# Altium project Hvamp_32.PrjPCB (part 2 of 2)

## Sheet Hvamp32_Supply.SchDoc: HVAMP_32
size 420 x 297 mm; EDA_Number: ARTIQ; Projet: Zotino; Author: G.Kasprowicz; CompanyName: WUT ISE; DrawnBy: G.Kasprowicz; Organization: WUT ISE; Address1: PW ISE; Address2: Nowowiejska 15/19 00-665 Warsaw; Address3: gkasprow@gmail.com; DocumentNumber: 3; Revision: 2; SheetNumber: 3; SheetTotal: 3; ModifiedBy: -; CheckedDate: -; Title2: Power Supply; DivGrp: WUT ISE; Designer: G.Kasprowicz; ModifiedDate: -; ProjectName: Sensor Box
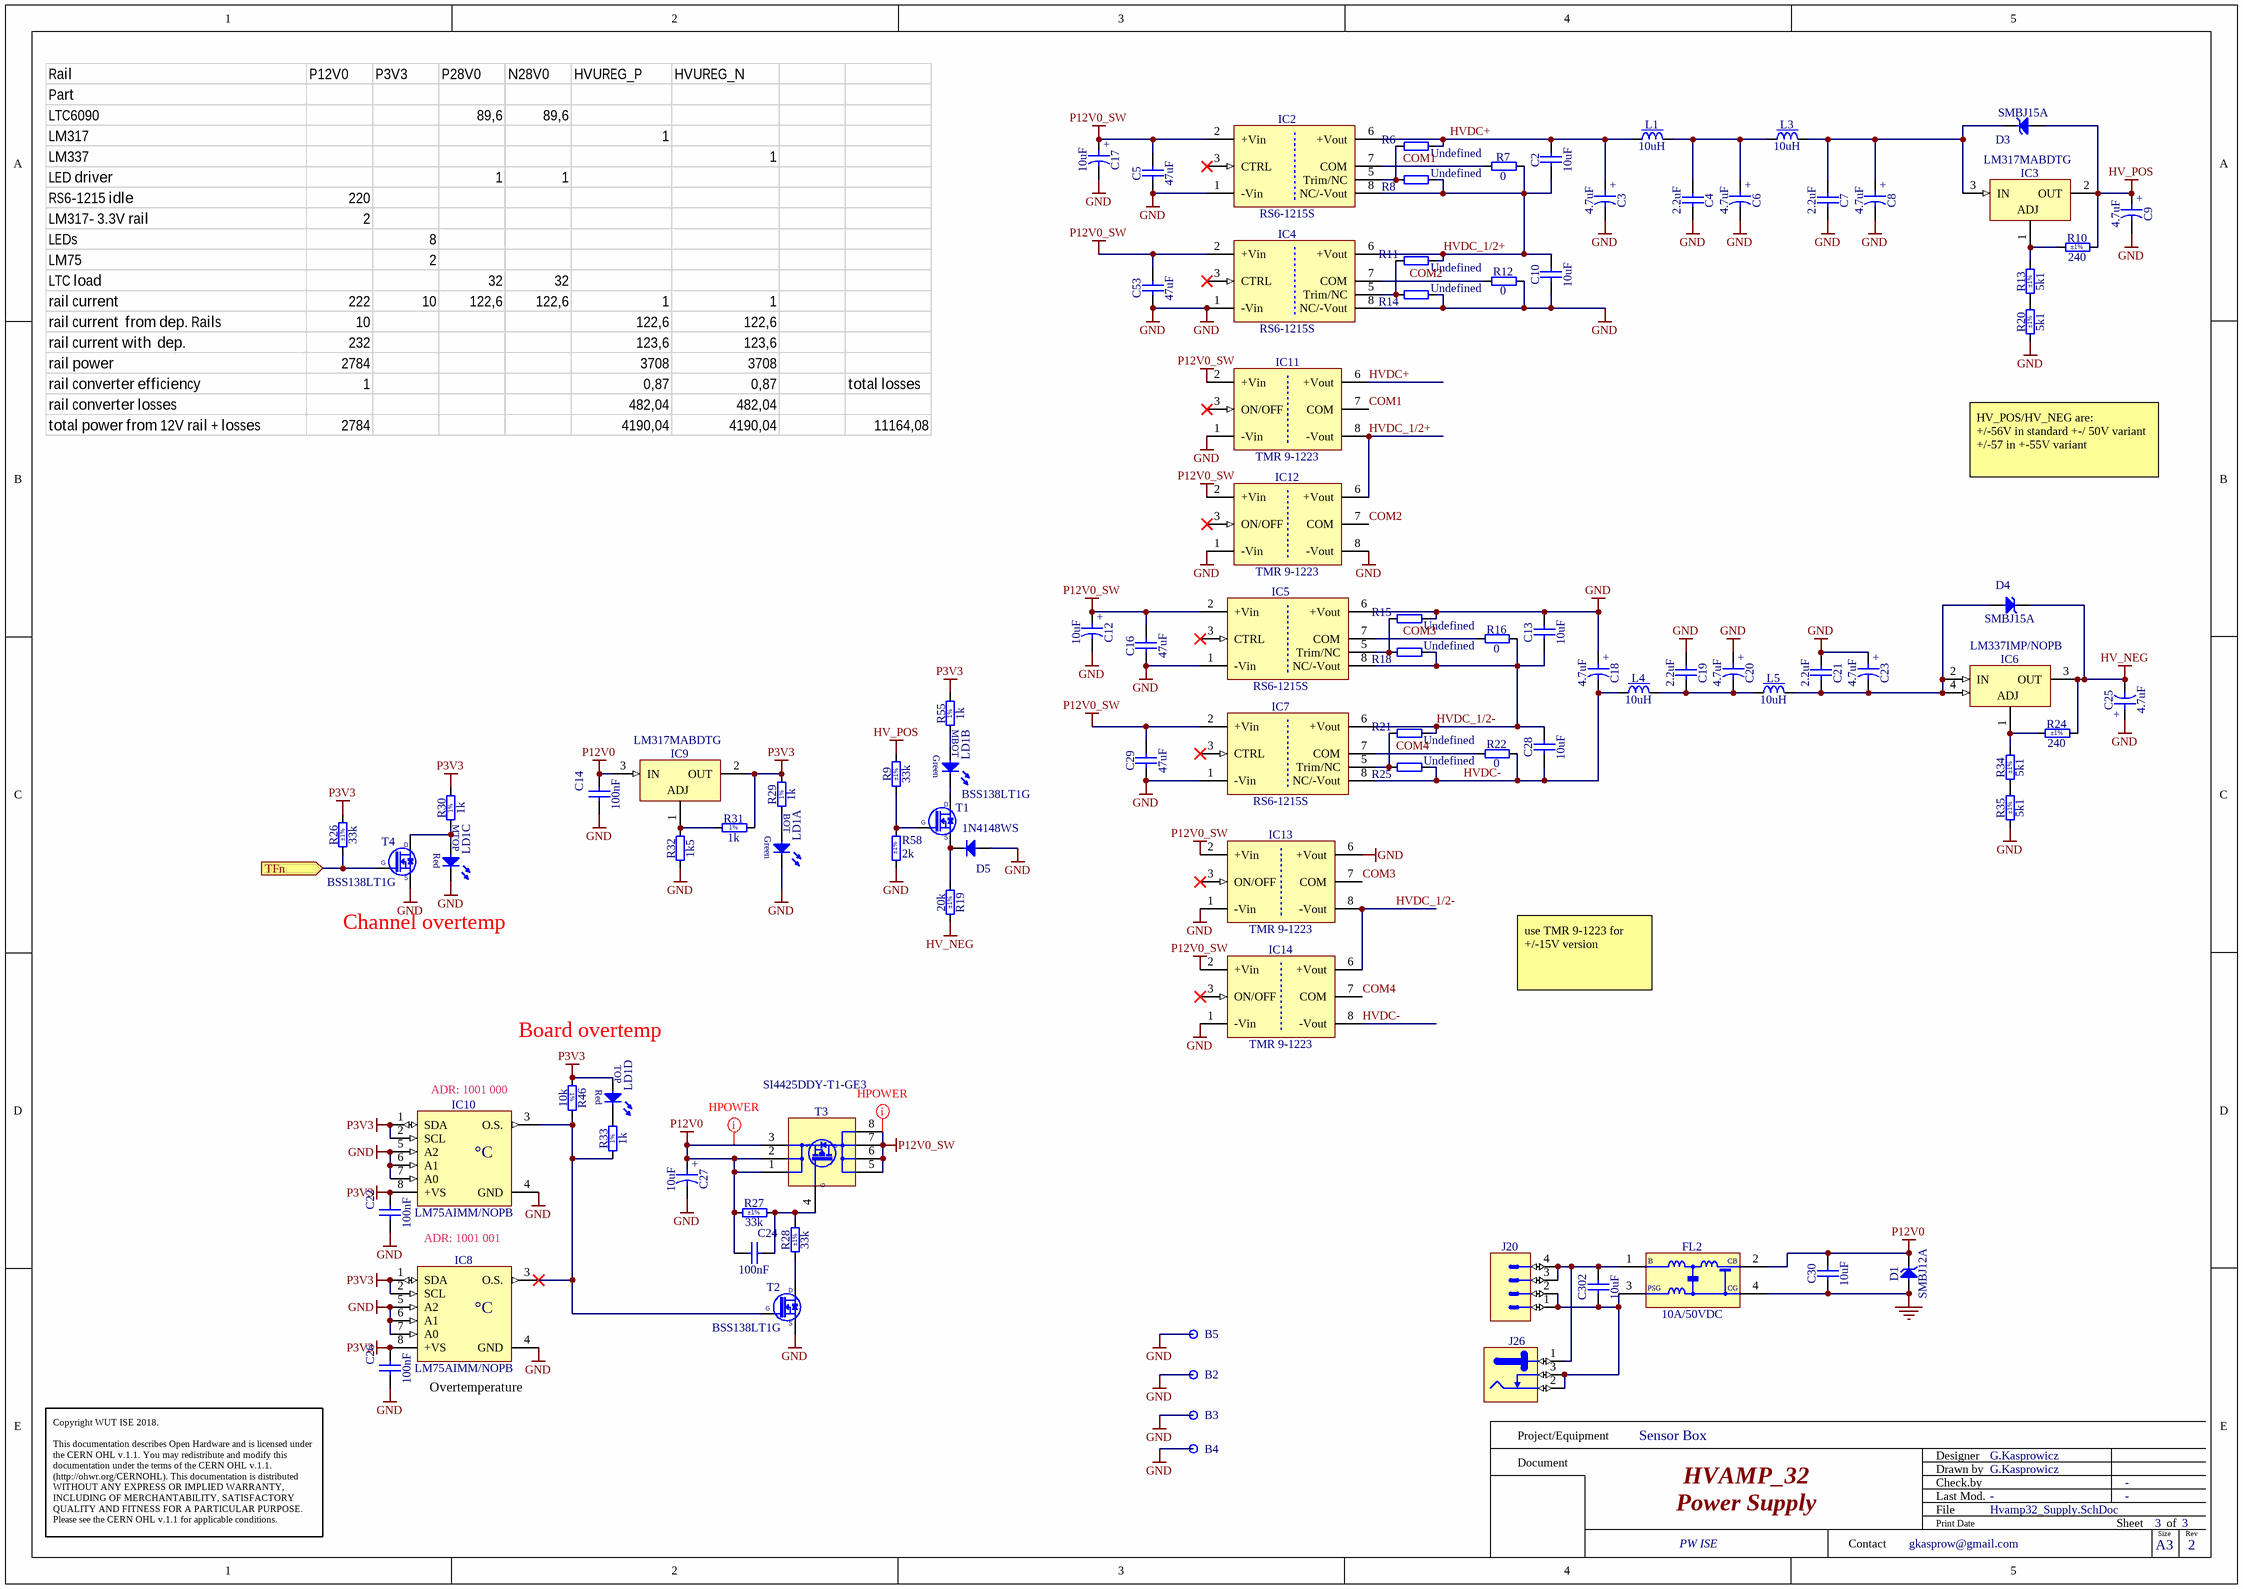
[diagram p2: Hvamp32_Supply.SchDoc]

### Parts
B2  Plated Hole  [MTG320_700]  (value not drawn)  (no BOM)
B3  Plated Hole  [MTG320_700]  (value not drawn)  (no BOM)
B4  Plated Hole  [MTG320_700]  (value not drawn)  (no BOM)
B5  Plated Hole  [MTG320_700]  (value not drawn)  (no BOM)
C2  10uF  [CAPC2012X145N]
C3  4.7uF  [CAPAE9383X100M]
C4  2.2uF  [CAPC3225X230N]
C5  47uF  [CAPC3225X270N]
C6  4.7uF  [CAPAE9383X100M]
C7  2.2uF  [CAPC3225X230N]
C8  4.7uF  [CAPAE9383X100M]
C9  4.7uF  [CAPAE9383X100M]
C10  10uF  [CAPC2012X145N]
C12  10uF  [CAPMP6032X280N]
C13  10uF  [CAPC2012X145N]
C14  100nF  [CAPC1608X90N]
C16  47uF  [CAPC3225X270N]
C17  10uF  [CAPMP6032X280N]
C18  4.7uF  [CAPAE9383X100M]
C19  2.2uF  [CAPC3225X230N]
C20  4.7uF  [CAPAE9383X100M]
C21  2.2uF  [CAPC3225X230N]
C22  100nF  [CAPC1608X90N]
C23  4.7uF  [CAPAE9383X100M]
C24  100nF  [CAPC1608X90N]
C25  4.7uF  [CAPAE9383X100M]
C26  100nF  [CAPC1608X90N]
C27  10uF  [CAPMP6032X280N]
C28  10uF  [CAPC2012X145N]
C29  47uF  [CAPC3225X270N]
C30  10uF  [CAPC2012X95N]
C53  47uF  [CAPC3225X270N]
C302  10uF  [CAPC2012X95N]
D1  SMBJ12A  [DIOM5336X265N]
D3  SMBJ15A  [DIOM5336X265N]
D4  SMBJ15A  [DIOM5336X265N]
D5  1N4148WS  [SODFL2512X100N]
FL2  10A/50VDC  [FIL_MURATA_BNX02]
IC2  RS6-1215S  [DCDC_RECOM_RS6]
IC3  LM317MABDTG  [DIODES-INC_TO-252-3L]
IC4  RS6-1215S  [DCDC_RECOM_RS6]
IC5  RS6-1215S  [DCDC_RECOM_RS6]
IC6  LM337IMP/NOPB  [SOT230P700X180-4N]
IC7  RS6-1215S  [DCDC_RECOM_RS6]
IC8  LM75AIMM/NOPB  [SOP65P490X109-8N]
IC9  LM317MABDTG  [DIODES-INC_TO-252-3L]
IC10  LM75AIMM/NOPB  [SOP65P490X109-8N]
IC11  TMR 9-1223  [DCDC_TRACO_TMR9WI]
IC12  TMR 9-1223  [DCDC_TRACO_TMR9WI]
IC13  TMR 9-1223  [DCDC_TRACO_TMR9WI]
IC14  TMR 9-1223  [DCDC_TRACO_TMR9WI]
J20  Mini-Fit Jr.™  [MOLEX_39-30-0040]  (value not drawn)
J26  Jack  [SWITCHCRAFT_712RA]  (value not drawn)
L1  10uH  [IND_MURATA-PS_8400]
L3  10uH  [IND_MURATA-PS_8400]
L4  10uH  [IND_MURATA-PS_8400]
L5  10uH  [IND_MURATA-PS_8400]
LD1  Green/Green/HeRed/HeRed  [LED_BIVAR_H485CHHGGDL]  (value not drawn)  (parts A,B,C,D of 4)
R6  Undefined  [RESC1608X55N]
R7  0  [RESC1608X55N]
R8  Undefined  [RESC1608X55N]
R9  33k  Tolerance: ±1%  [RESC1608X55N]
R10  240  Tolerance: ±1%  [RESC1608X55N]
R11  Undefined  [RESC1608X55N]
R12  0  [RESC1608X55N]
R13  5k1  Tolerance: ±1%  [RESC3216X65N]
R14  Undefined  [RESC1608X55N]
R15  Undefined  [RESC1608X55N]
R16  0  [RESC1608X55N]
R18  Undefined  [RESC1608X55N]
R19  20k  Tolerance: ±1%  [RESC1608X55N]
R20  5k1  Tolerance: ±1%  [RESC3216X65N]
R21  Undefined  [RESC1608X55N]
R22  0  [RESC1608X55N]
R24  240  Tolerance: ±1%  [RESC1608X55N]
R25  Undefined  [RESC1608X55N]
R26  33k  Tolerance: ±1%  [RESC1608X55N]
R27  33k  Tolerance: ±1%  [RESC1608X55N]
R28  33k  Tolerance: ±1%  [RESC1608X55N]
R29  1k  [RESC1005X40N]
R30  1k  [RESC1005X40N]
R31  1k  [RESC1005X40N]
R32  1k5  [RESC1005X40N]
R33  1k  [RESC1005X40N]
R34  5k1  Tolerance: ±1%  [RESC3216X65N]
R35  5k1  Tolerance: ±1%  [RESC3216X65N]
R46  10k  [RESC1005X40N]
R55  1k  [RESC1005X40N]
R58  2k  Tolerance: ±1%  [RESC1005X40N]
T1  BSS138LT1G  [SOT95P240X110-3N]
T2  BSS138LT1G  [SOT95P240X110-3N]
T3  SI4425DDY-T1-GE3  [SOIC127P600X175-8N]
T4  BSS138LT1G  [SOT95P240X110-3N]

### Ports
TFn (in)

### Nets
GND: B2.1 B3.1 B4.1 B5.1 C3.2 C4.2 C5.1 C6.2 C7.2 C8.2 C9.2 C10.1 C12.2 C13.2 C14.1 C16.1 C17.2 C18.1 C19.1 C20.1 C21.1 C22.1 C23.1 C25.1 C26.1 C27.2 C29.1 C30.1 C53.1 D1.2(A) D5.2(A) FL2.4(CG) IC2.1(-Vin) IC4.1(-Vin) IC4.8(NC/-Vout) IC5.1(-Vin) IC5.6(+Vout) IC7.1(-Vin) IC8.4(GND) IC8.5(A2) IC8.6(A1) IC8.7(A0) IC10.4(GND) IC10.5(A2) IC10.6(A1) IC10.7(A0) IC11.1(-Vin) IC12.1(-Vin) IC12.8(-Vout) IC13.1(-Vin) IC13.6(+Vout) IC14.1(-Vin) LD1.1(C) LD1.5(C) R12.2 R14.2 R15.2 R20.1 R32.1 R35.1 R58.1 T2.2(S) T4.2(S)
HV_NEG: C25.2 D4.1(C) IC6.3(OUT) R19.2 R24.2
HV_POS: C9.1 D3.2(A) IC3.2(OUT) R9.2 R10.2
P3V3: C22.2 C26.2 IC8.1(SDA) IC8.2(SCL) IC8.8(+VS) IC9.2(OUT) IC10.1(SDA) IC10.2(SCL) IC10.8(+VS) LD1.8(A) R26.2 R29.2 R30.2 R31.2 R46.1 R55.2
P12V0: C14.2 C24.1 C27.1 C30.2 D1.1(C) FL2.2(CB) IC9.3(IN) R27.1 T3.1(S) T3.2(S) T3.3(S)
P12V0_SW: C5.2 C12.1 C16.2 C17.1 C29.2 C53.2 IC2.2(+Vin) IC4.2(+Vin) IC5.2(+Vin) IC7.2(+Vin) IC11.2(+Vin) IC12.2(+Vin) IC13.2(+Vin) IC14.2(+Vin) T3.5(D) T3.6(D) T3.7(D) T3.8(D)
COM1: IC2.7(COM) IC11.7(COM) R7.1
COM2: IC4.7(COM) IC12.7(COM) R12.1
COM3: IC5.7(COM) IC13.7(COM) R16.1
COM4: IC7.7(COM) IC14.7(COM) R22.1
HVDC+: C2.2 C3.1 IC2.6(+Vout) IC11.6(+Vout) L1.1 R6.2
HVDC-: C18.2 C28.1 IC7.8(NC/-Vout) IC14.8(-Vout) L4.1 R22.2 R25.2
HVDC_1/2+: C2.1 C10.2 IC2.8(NC/-Vout) IC4.6(+Vout) IC11.8(-Vout) IC12.6(+Vout) R7.2 R8.2 R11.2
HVDC_1/2-: C13.1 C28.2 IC5.8(NC/-Vout) IC7.6(+Vout) IC13.8(-Vout) IC14.6(+Vout) R16.2 R18.2 R21.2
NetC4_1: C4.1 C6.1 L1.2 L3.1
NetC7_1: C7.1 C8.1 D3.1(C) IC3.3(IN) L3.2
NetC19_2: C19.2 C20.2 L4.2 L5.1
NetC21_2: C21.2 C23.2 D4.2(A) IC6.2(IN) IC6.4(IN) L5.2
NetC24_2: C24.2 R27.2 R28.2 T3.4(S)
NetC302_1: C302.1 FL2.3(PSG) J20.1 J20.2 J26.2 J26.3
NetC302_2: C302.2 FL2.1(B) J20.3 J20.4 J26.1
NetD2_1_2: R26.1 T4.1(G) ; port TFn
NetD5_1: D5.1(C) R19.1 T1.2(S)
NetIC2_5: IC2.5(Trim/NC) R6.1 R8.1
NetIC3_1: IC3.1(ADJ) R10.1 R13.2
NetIC4_5: IC4.5(Trim/NC) R11.1 R14.1
NetIC5_5: IC5.5(Trim/NC) R15.1 R18.1
NetIC6_1: IC6.1(ADJ) R24.1 R34.2
NetIC7_5: IC7.5(Trim/NC) R21.1 R25.1
NetIC8_3: IC8.3(O.S.) IC10.3(O.S.) R33.1 R46.2 T2.1(G)
NetIC9_1: IC9.1(ADJ) R31.1 R32.2
NetLD1_2: LD1.2(A) R29.1
NetLD1_3: LD1.3(C) T1.3(D)
NetLD1_4: LD1.4(A) R55.1
NetLD1_6: LD1.6(A) R30.1 T4.3(D)
NetLD1_7: LD1.7(C) R33.2
NetR9_1: R9.1 R58.2 T1.1(G)
NetR13_1: R13.1 R20.2
NetR28_1: R28.1 T2.3(D)
NetR34_1: R34.1 R35.2

Not connected (* = marked no-connect by the designer): IC2 3(CTRL)*; IC4 3(CTRL)*; IC5 3(CTRL)*; IC7 3(CTRL)*; IC11 3(ON/OFF)*; IC12 3(ON/OFF)*; IC13 3(ON/OFF)*; IC14 3(ON/OFF)*

### Layout directives
net class Hpower: P12V0, P12V0_SW

### Notes on the sheet
- HV_POS/HV_NEG are:
  +/-56V in standard +-/ 50V variant
  +/-57 in +-55V variant
- Channel overtemp
- use TMR 9-1223 for +/-15V version
- Board overtemp
- (near IC10) ADR: 1001 000
- ADR: 1001 001
- Overtemperature
- Project/Equipment
- Document
- Designer
- Drawn by
- Check.by
- Copyright WUT ISE 2018.
  This documentation describes Open Hardware and is licensed under the CERN OHL v.1.1. You may redistribute and modify this documentation under the terms of the CERN OHL v.1.1. (http://ohwr.org/CERNOHL). This documentation is distributed WITHOUT ANY EXPRESS OR IMPLIED WARRANTY, INCLUDING OF MERCHANTABILITY, SATISFACTORY QUALITY AND FITNESS FOR A PARTICULAR PURPOSE. Please see the CERN OHL v.1.1 for applicable conditions.
- Contact
- File
- Last Mod.
- Print Date
- Sheet
- Size
- A3
- of
- Rev
- (in symbol CAP_ELECTRO_F_4.7u_250V) +
- (in symbol CTE6032-28_10UF_25V_10%_LESR0500) +
- (in symbol LED_BIVAR_H485CHHGGDL, part A) BOT; Green
- (in symbol LED_BIVAR_H485CHHGGDL, part B) MBOT; Green
- (in symbol LED_BIVAR_H485CHHGGDL, part C) MTOP; Red
- (in symbol LED_BIVAR_H485CHHGGDL, part D) TOP; Red
- (in symbol LM75AIMM/NOPB) °C
- (in symbol R0402_1k_1%_0.0625W_100PPM) 1%
- (in symbol R0402_10K_1%_0.0625W_100PPM) 1%
- (in symbol SI4425DDY-T1-GE3) G

### Library data of the parts
B2-B5 = PLATED_HOLE3.2_PAD7.0: Single Terminal Socket; Part Description: Plated Through Hole: Hole Dia.=3.2mm Pad Dia.=7.0mm; Mounted: No; Part Number: PLATED_HOLE3.2_PAD7.0; Component Type: Standard (No BOM); Pin Count: 1; Family: Plated Hole; Socket: No; SMD: No; Sense: No; Status: None; ComponentHeight: 0mm; HelpURL: Undefined; Author: CERN DEM JMW; CreateDate: 28.11.2017; LatestRevisionDate: 28.11.2017; PackageDescription: Plated Through Hole: Hole Dia.=3.2mm Pad Dia.=7.0mm
C2 C10 C13 C28 = CC0805_10UF_35V_10%_X5R_MURATA_GRM21BR6YA106KE43L: Non-polarised capacitor; Part Description: Chip Multilayer Ceramic Capacitor for General Purpose; Manufacturer: MURATA; Voltage: 35V; TC: X5R; Tolerance: ±10%; Part Number: CC0805_10UF_35V_10%_X5R_MURATA_GRM21BR6YA106KE43L; Component Kind: Standard; Component Type: Standard; Pin Count: 2; Value: 10uF; Status: Not Recommended; Manufacturer Part Number: GRM21BR6YA106KE43; Case: 0805; Mounted: Yes; Socket: No; SMD: Yes; Sense: No; ComponentHeight: 1.45mm; HelpURL: \\cern.ch\dfs\Applications\Altium\Datasheets\CC0805_MURATA_GRM21BR6YA106KE43L.pdf; Author: CERN DEM BC; CreateDate: 24.03.2020; LatestRevisionDate: 24.03.2020
C3 C6 C8 C9 C18 C20 C23 C25 = CAP_ELECTRO_F_4.7u_250V: Electrolytic capacitor 4.7uF 250V; Part Number: CAE800-1000_4.7UF_250V_20%; Part Description: Aluminum Electrolytic SMT Capacitor; Manufacturer: Nichicon; Manufacturer Part Number: UUX2E4R7MNL1GS; Tolerance: ±20%; Component Kind: Standard; Component Type: Standard; Pin Count: 2; Value: 4.7uF; Status: Recommended; Voltage: 250V; Case: F; Mounted: Yes; Socket: No; SMD: Yes; Sense: No; ComponentHeight: 10.2mm; HelpURL: \\cern.ch\dfs\Applications\Altium\Datasheets\CAE_PANASONIC_FK.pdf; Author: GK; CreateDate: 03.12.2007; LatestRevisionDate: 05.11.2014
C4 C7 C19 C21 = CC1210_2.2UF_100V_10%_X7R_MURATA_GCJ32DR72A225KA01L: Non-polarised capacitor; Part Description: Soft Termination SMD Chip Monolithic Ceramic Capacitor for Automotive; Manufacturer: MURATA; Voltage: 100V; TC: X7R; Tolerance: ±10%; Part Number: CC1210_2.2UF_100V_10%_X7R_MURATA_GCJ32DR72A225KA01L; Component Kind: Standard; Component Type: Standard; Pin Count: 2; Value: 2.2uF; Status: Not Recommended; Manufacturer Part Number: GCJ32DR72A225KA01L; Case: 1210; Mounted: Yes; Socket: No; SMD: Yes; Sense: No; ComponentHeight: 2.3mm; HelpURL: \\cern.ch\dfs\Applications\Altium\Datasheets\CC1210_MURATA_GCJ32DR72A225KA01L.pdf; Author: CERN DEM JLC; CreateDate: 10.05.2017; LatestRevisionDate: 10.05.2017
C5 C16 C29 C53 = CC1210_47UF_16V_20%_X5R: Non-polarised capacitor; Part Description: SMD Multilayer Chip Ceramic Capacitor; Manufacturer: GENERIC; Manufacturer1 Part Number: EMK325BJ476MM-T; Voltage: 16V; TC: X5R; Tolerance: ±20%; Part Number: CC1210_47UF_16V_20%_X5R; Component Kind: Standard; Component Type: Standard; Pin Count: 2; Value: 47uF; Status: None; Manufacturer Part Number: CC1210_47UF_16V_20%_X5R; Case: 1210; Mounted: Yes; Socket: No; SMD: Yes; Sense: No; Manufacturer1 Example: TAIYO YUDEN; Manufacturer1 ComponentHeight: 2.7mm; HelpURL: \\cern.ch\dfs\Applications\Altium\Datasheets\CC1210_X5R_TAIYO-YUDEN_HIGH-VALUE.pdf; Author: CERN DEM MR; CreateDate: 03.02.2016; LatestRevisionDate: 03.02.2016
C12 C17 C27 = CTE6032-28_10UF_25V_10%_LESR0500: Polarised capacitor; Part Description: Low ESR 0R5 Solid Tantalum Chip Capacitor; Manufacturer: GENERIC; Manufacturer1 Part Number: TPSC106K025R0500; Voltage: 25V; Tolerance: ±10%; Part Number: CTE6032-28_10UF_25V_10%_LESR0500; Component Kind: Standard; Component Type: Standard; Pin Count: 2; Value: 10uF; Status: Preferred; Manufacturer Part Number: CTE6032-28_10UF_25V_10%_LESR0500; Case: C; Mounted: Yes; Socket: No; SMD: Yes; Sense: No; Manufacturer1 Example: AVX; Manufacturer1 ComponentHeight: 2.8mm; HelpURL: \\cern.ch\dfs\Applications\Altium\Datasheets\CTE-LESR_AVX_TPS.pdf; Author: CERN DEM JLC; CreateDate: 05/05/2008; LatestRevisionDate: 20/01/2009
C14 C22 C24 C26 = CC0603_100NF_100V_10%_X7R: Non-polarised capacitor; Part Description: SMD Multilayer Chip Ceramic Capacitor; Manufacturer: GENERIC; Manufacturer1 Part Number: GRM188R72A104KA35D; Voltage: 100V; TC: X7R; Tolerance: ±10%; Part Number: CC0603_100NF_100V_10%_X7R; Component Kind: Standard; Component Type: Standard; Pin Count: 2; Value: 100nF; Status: None; Manufacturer Part Number: CC0603_100NF_100V_10%_X7R; Case: 0603; Mounted: Yes; Socket: No; SMD: Yes; Sense: No; Manufacturer1 Example: MURATA; Manufacturer1 ComponentHeight: 0.9mm; HelpURL: \\cern.ch\dfs\Applications\Altium\Datasheets\CC0603_MURATA_GRM188R72A104KA35D.pdf; Author: CERN DEM JLC; CreateDate: 11.12.2013; LatestRevisionDate: 11.12.2013
C30 C302 = CC0805_10UF_25V_10%_X5R: Non-polarised capacitor; Part Description: SMD Multilayer Chip Ceramic Capacitor; Manufacturer: GENERIC; Manufacturer1 Part Number: GRM219R61E106KA12D; Voltage: 25V; TC: X5R; Tolerance: ±10%; Part Number: CC0805_10UF_25V_10%_X5R; Component Kind: Standard; Component Type: Standard; Pin Count: 2; Value: 10uF; Status: Preferred; Manufacturer Part Number: CC0805_10UF_25V_10%_X5R; Case: 0805; Mounted: Yes; Socket: No; SMD: Yes; Sense: No; Manufacturer1 Example: MURATA; Manufacturer1 ComponentHeight: 0.95mm; HelpURL: \\cern.ch\dfs\Applications\Altium\Datasheets\CC0805_X5R_MURATA_GRM.pdf; Author: CERN DEM JLC; CreateDate: 25.10.2012; LatestRevisionDate: 06.09.2016
D1 = SMBJ12A: Zener Diode; Part Description: Uni-Directional Transient Voltage Suppressor Diode; Manufacturer: FAIRCHILD SEMICONDUCTOR; Voltage: 12V; Power: 600W; PressFit: No; Bonding: No; Part Number: SMBJ12A; Component Kind: Standard; Component Type: Standard; Device: SMBJ12A; PackageDescription: DO-214-AA/SMB Diode, Molded Body; 5.34mm L X 3.625mm W X 2.65mm H, IPC Medium Density; Manufacturer Part Number: SMBJ12A; Pin Count: 2; Case: DO-214AA; Mounted: Yes; Socket: No; SMD: Yes; Sense: No; ComponentHeight: 2.65mm; HelpURL: \\cern.ch\dfs\Applications\Altium\Datasheets\SMBJ.pdf; Author: CERN DEM JLC; CreateDate: 10.04.2013; LatestRevisionDate: 10.04.2013
D3 D4 = SMBJ15A: Zener Diode; Part Description: Uni-Directional Transient Voltage Suppressor Diode; Manufacturer: FAIRCHILD SEMICONDUCTOR; Voltage: 15V; Power: 600W; PressFit: No; Bonding: No; Part Number: SMBJ15A; Component Kind: Standard; Component Type: Standard; Device: SMBJ15A; PackageDescription: DO-214-AA/SMB Diode, Molded Body; 5.34mm L X 3.625mm W X 2.65mm H, IPC Medium Density; Manufacturer Part Number: SMBJ15A; Pin Count: 2; Case: DO-214AA; Mounted: Yes; Socket: No; SMD: Yes; Sense: No; ComponentHeight: 2.65mm; HelpURL: \\cern.ch\dfs\Applications\Altium\Datasheets\SMBJ.pdf; Author: CERN DEM JLC; CreateDate: 08.12.2008; LatestRevisionDate: 19.12.2011
D5 = 1N4148WS: Diode; Part Description: Small Signal Diodes; Manufacturer: FAIRCHILD SEMICONDUCTOR; Voltage: 75V; Power: 150mA; PressFit: No; Bonding: No; Part Number: 1N4148WS; Component Kind: Standard; Component Type: Standard; Device: 1N4148WS; PackageDescription: SODFL Diode (SOD323F); 1.70mm W X 1.25mm L X 1.00mm H body, IPC Medium Density; Manufacturer Part Number: 1N4148WS; Pin Count: 2; Case: SOD-323F; Mounted: Yes; Socket: No; SMD: Yes; Sense: No; ComponentHeight: 1mm; HelpURL: \\cern.ch\dfs\Applications\Altium\Datasheets\1N4148WS.pdf; Author: CERN DEM JLC; CreateDate: 12.05.2011; LatestRevisionDate: 12.05.2011
FL2 = FIL_MURATA_BNX022-01L: Block Type EMIFIL (LC Combined); Part Description: Block Type EMIFIL (LC Combined) SMD Type, BNX02* Series; Manufacturer: MURATA; Resistance: 0.5R; Part Number: FIL_MURATA_BNX022-01L; Component Kind: Standard; Component Type: Standard; Pin Count: 2; Value: 10A/50VDC; Status: None; Manufacturer Part Number: BNX022-01L; Mounted: Yes; Socket: No; SMD: Yes; Sense: No; ComponentHeight: 3.3mm; HelpURL: \\cern.ch\dfs\Applications\Altium\Datasheets\FIL_MURATA_BNX022-01L.pdf; Author: CERN DEM JLC; CreateDate: 10.10.2012; LatestRevisionDate: 10.10.2012
IC2 IC4 IC5 IC7 = DCDC_RS6-1215S: 12VDC to 15VDC, Iout 400mA, 2kVDC Isolated, 6W DC-DC Converter; Manufacturer: RECOM; PressFit: No; Bonding: No; Part Number: RS6-1215S; Component Kind: Standard; Component Type: Standard; Device: RS6-1215S; PackageDescription: RS6 Series, Body 21.8x9.2mm, Compact SIP-8 Package; Part Description: 12VDC to 15VDC, Iout 400mA, 2kVDC Isolated, 6W DC-DC Converter; Manufacturer Part Number: RS6-1215S; Pin Count: 7; Mounted: Yes; Socket: No; SMD: No; Sense: No; ComponentHeight: 11.6mm; HelpURL: \\cern.ch\dfs\Applications\Altium\Datasheets\RS6-2415D.pdf; Author: GK; CreateDate: 19.06.2017; LatestRevisionDate: 19.06.2017
IC3 IC9 = REG_LM317MABDTG: 1.2-37V 500mA Low Dropout Positive Regulator; Manufacturer: ONSEMI; PressFit: No; Bonding: No; Part Number: LM317MABDTG; Component Kind: Standard; Component Type: Standard; Device: LM317MABDTG; PackageDescription: TO-252 DPAK TO, 2.28mm Pitch; 2 Pin, 9.7mm L X 6.7mm W X 2.40mm H body; Part Description: 1.2-37V 500mA Low Dropout Positive Regulator; Manufacturer Part Number: LM317MABDTG; Pin Count: 3; Case: TO-252; Mounted: Yes; Socket: No; SMD: Yes; Sense: No; ComponentHeight: 2.4mm; HelpURL: \\cern.ch\dfs\Applications\Altium\Datasheets\AP1117D18G-13.pdf; Author: GK; CreateDate: 03.10.2012; LatestRevisionDate: 03.10.2012
IC6 = LM337IMP/NOPB: 3-Terminal Regulator 1=Adj 2=IN 3=OUT 4=IN; Part Description: 3-Terminal -1.2V To -37V 1A Adjustable Negative Regulator; Manufacturer: TEXAS INSTRUMENTS; PressFit: No; Bonding: No; Part Number: LM337IMP/NOPB; Component Kind: Standard; Component Type: Standard; Device: LM337IMP/NOPB; PackageDescription: SOT223, 2.30mm Pitch; 4 Pin, 3.70mm W X 6.70mm L X 1.80mm H body, IPC Medium Density; Manufacturer Part Number: LM337IMP/NOPB; Pin Count: 4; Case: SOT223; Mounted: Yes; Socket: No; SMD: Yes; Sense: No; ComponentHeight: 1.8mm; HelpURL: \\cern.ch\dfs\Applications\Altium\Datasheets\LM337IMP-NOPB.pdf; Author: CERN DEM JLC; CreateDate: 31.08.2010; LatestRevisionDate: 21.09.2015
IC8 IC10 = LM75AIMM/NOPB: Digital Temperature Sensor and Thermal Watchdog with Two-Wire Interface; Part Description: -25° to +100°C ±2°C Digital Temperature Sensor and Thermal Watchdog with Two-Wire Interface; Manufacturer: TEXAS INSTRUMENTS; PressFit: No; Bonding: No; Part Number: LM75AIMM/NOPB; Component Kind: Standard; Component Type: Standard; Device: LM75AIMM/NOPB; PackageDescription: SOP, 0.65mm pitch; 8 pin,3.00mm W X 3.00mm L X 1.09mm H bodyI, PC Medium Density; Manufacturer Part Number: LM75AIMM/NOPB; Pin Count: 8; Case: SSOP8; Mounted: Yes; Socket: No; SMD: Yes; Sense: No; ComponentHeight: 1.09mm; HelpURL: \\cern.ch\dfs\Applications\Altium\Datasheets\LM75AIMM-NOPB.pdf; Author: CERN DEM JLC; CreateDate: 15.10.2012; LatestRevisionDate: 15.10.2012
IC11-IC14 = DCDC_TRACO_TMR 9-1223: TRACO, TMR 9 WI Series, Dual Output DCDC Converter; Part Description: 9-18VDC to ±15VDC, Iout (max) ±300mA, 9W DC-DC Converter; Manufacturer: TRACO POWER; PressFit: No; Bonding: No; Part Number: TMR 9-1223; Component Kind: Standard; Component Type: Standard; Device: TMR 9-1223; PackageDescription: TMR 9 WI Series, Body 21.8x9.6mm, Compact SIP-8 Package; Manufacturer Part Number: TMR 9-1223; Pin Count: 6; Mounted: Yes; Socket: No; SMD: No; Sense: No; ComponentHeight: 11.7mm; HelpURL: \\cern.ch\dfs\Applications\Altium\Datasheets\TMR 9-4822WI.pdf; Author: GK; CreateDate: 11.07.2017; LatestRevisionDate: 11.07.2017
J20 = MOLEX_39-30-0040: Connector 4 Male; Part Description: 4.20mm (.165") Pitch Mini-Fit Jr. Header, Dual Row, Right Angle with Snap-in Plastic Peg PCB Lock, 4 Circuits; Manufacturer: MOLEX; PressFit: No; Part Number: MOLEX_39-30-0040; Component Kind: Standard; Component Type: Standard; Pin Count: 4; Family: Mini-Fit Jr.™; Mounted: Yes; Socket: No; SMD: No; Sense: No; Status: None; Manufacturer Part Number: 39-30-0040; ComponentHeight: 11.4mm; HelpURL: \\cern.ch\dfs\Applications\Altium\Datasheets\MOLEX_39-30-0040.pdf; Author: CERN DEM JLC; CreateDate: 2018-10-02; LatestRevisionDate: 2018-10-02
J26 = SWITCHCRAFT_712RA: 2.5 mm Center Pin, 5A, 48V, Right Angle, Through Hole, , DC Power Jack Connector; Part Description: 2.5 mm Center Pin, 5A, 48VDC, Right Angle, Through Hole, Locking Power Jack Connector (Threaded Bushings); Manufacturer Part Number: 712RA; PressFit: No; Part Number: SWITCHCRAFT_712RA; Component Kind: Standard; Component Type: Standard; Pin Count: 3; Family: Jack; Mounted: Yes; Socket: No; SMD: No; Sense: No; Status: None; Manufacturer: SWITCHCRAFT; ComponentHeight: 13.8mm; HelpURL: \\cern.ch\dfs\Applications\Altium\Datasheets\SWITCHCRAFT_712RA.pdf; Author: CERN DEM JLC; CreateDate: 2017-12-19; LatestRevisionDate: 2017-12-19
L1 L3-L5 = IND_10UH_10%_MURATA-PS_8400: Inductor With Core; Part Description: Miniature Surface Mount Power Inductor (8400 Serie); Manufacturer: MURATA POWER SOLUTIONS; Manufacturer Part Number: 84103C; Power: 950mA; Resistance: 0.24R; Tolerance: ±10%; Part Number: IND_10UH_10%_MURATA-PS_8400; Component Kind: Standard; Component Type: Standard; Pin Count: 2; Value: 10uH; Status: None; Mounted: Yes; Socket: No; SMD: Yes; Sense: No; ComponentHeight: 2.9mm; HelpURL: \\cern.ch\dfs\Applications\Altium\Datasheets\IND_MURATA-PS_8400.pdf; Author: CERN DEM JLC; CreateDate: 02.07.2012; LatestRevisionDate: 02.07.2012
LD1 = LED_BIVAR_H485CHHGGDL: LED x4 G-1C2A-BOT_G-3C4A_H-5C6A_H-7C8A-TOP; Part Description: Quad-Level 2mm (Green+Green+HeRed+HeRed) LED, PCB Edge Mounting; Manufacturer: BIVAR; PressFit: No; Bonding: No; Part Number: LED_BIVAR_H485CHHGGDL; Component Kind: Standard; Component Type: Standard; Color: Green/Green/HeRed/HeRed; PackageDescription: Quad-Level 2mm (Green+Green+HeRed+HeRed) LED, PCB Edge Mounting  BIVAR H485C Serie; Status: Not Recommended; Manufacturer Part Number: H485CHHGGDL; Pin Count: 8; Mounted: Yes; Socket: No; SMD: No; Sense: No; ComponentHeight: 11.3mm; HelpURL: \\cern.ch\dfs\Applications\Altium\Datasheets\LED_BIVAR_H485C.pdf; Author: CERN DEM BC; CreateDate: 12/11/2015; LatestRevisionDate: 12/11/2015
R6 R8 R11 R14 R15 R18 R21 R25 = R0603_NO-VALUE: Resistor; Part Description: Reserved Footprint For a 0603 (1608) Chip Resistor; PressFit: No; Mounted: No; Part Number: R0603_NO-VALUE; Component Kind: Standard; Component Type: Standard; Pin Count: 2; Value: Undefined; Status: None; Manufacturer: Undefined; Manufacturer Part Number: R0603_NO-VALUE; Case: 0603; Sense: No; Socket: No; SMD: Yes; Manufacturer1 Example: Undefined; Manufacturer1 Part Number: Undefined; Manufacturer1 ComponentHeight: Undefined; HelpURL: Undefined; Author: CERN DEM JLC; CreateDate: 03.12.2007; LatestRevisionDate: 13.03.2008
R7 R12 R16 R22 = R0603_0R_JUMPER: Resistor; Part Description: 1A (0.05R Max DC Resistance) Zero Ohm Jumper; Manufacturer: GENERIC; Manufacturer1 Part Number: NRC06Z0; PressFit: No; Part Number: R0603_0R_JUMPER; Component Kind: Standard; Component Type: Standard; Pin Count: 2; Value: 0; Status: Preferred; Manufacturer Part Number: R0603_0R_JUMPER; Case: 0603; Mounted: Yes; Sense: No; Socket: No; SMD: Yes; Manufacturer1 Example: NIC COMPONENT; Manufacturer1 ComponentHeight: 0.55mm; HelpURL: \\cern.ch\dfs\Applications\Altium\Datasheets\R0603_NIC_NRC.pdf; Author: CERN DEM JLC; CreateDate: 03.12.2007; LatestRevisionDate: 13.03.2008
R9 R26-R28 = R0603_33K_1%_0.1W_100PPM: Resistor - 1%; Part Description: General Purpose Thick Film Chip Resistor; Manufacturer: GENERIC; Manufacturer1 Part Number: NRC06F3302TRF; Power: 0.1W; TC: ±100ppm/°C; PressFit: No; Part Number: R0603_33K_1%_0.1W_100PPM; Component Kind: Standard; Component Type: Standard; Pin Count: 2; Value: 33k; Status: Preferred; Manufacturer Part Number: R0603_33K_1%_0.1W_100PPM; Case: 0603; Mounted: Yes; Sense: No; Socket: No; SMD: Yes; Manufacturer1 Example: NIC COMPONENT; Manufacturer1 ComponentHeight: 0.55mm; HelpURL: \\cern.ch\dfs\Applications\Altium\Datasheets\R0603_NIC_NRC.pdf; Author: CERN DEM JLC; CreateDate: 03.12.2007; LatestRevisionDate: 13.03.2008
R10 R24 = R0603_240R_1%_0.1W_100PPM: Resistor - 1%; Part Description: General Purpose Thick Film Chip Resistor; Manufacturer: GENERIC; Manufacturer1 Part Number: NRC06F2400TRF; Power: 0.1W; TC: ±100ppm/°C; PressFit: No; Part Number: R0603_240R_1%_0.1W_100PPM; Component Kind: Standard; Component Type: Standard; Pin Count: 2; Value: 240; Status: Preferred; Manufacturer Part Number: R0603_240R_1%_0.1W_100PPM; Case: 0603; Mounted: Yes; Sense: No; Socket: No; SMD: Yes; Manufacturer1 Example: NIC COMPONENT; Manufacturer1 ComponentHeight: 0.55mm; HelpURL: \\cern.ch\dfs\Applications\Altium\Datasheets\R0603_NIC_NRC.pdf; Author: CERN DEM JLC; CreateDate: 03.12.2007; LatestRevisionDate: 13.03.2008
R13 R20 R34 R35 = R1206_5K1_1%_0.25W_100PPM: Resistor - 1%; Part Description: General Purpose Thick Film Chip Resistor; Manufacturer: GENERIC; Manufacturer1 Part Number: NRC12F5101TRF; Power: 0.25W; TC: ±100ppm/°C; PressFit: No; Part Number: R1206_5K1_1%_0.25W_100PPM; Component Kind: Standard; Component Type: Standard; Pin Count: 2; Value: 5k1; Status: Preferred; Manufacturer Part Number: R1206_5K1_1%_0.25W_100PPM; Case: 1206; Mounted: Yes; Sense: No; Socket: No; SMD: Yes; Manufacturer1 Example: NIC COMPONENT; Manufacturer1 ComponentHeight: 0.65mm; HelpURL: \\cern.ch\dfs\Applications\Altium\Datasheets\R1206_NIC_NRC.pdf; Author: CERN DEM JLC; CreateDate: 03.12.2007; LatestRevisionDate: 13.03.2008
R19 = R0603_20K_1%_0.1W_100PPM: Resistor - 1%; Part Description: General Purpose Thick Film Chip Resistor; Manufacturer: GENERIC; Manufacturer1 Part Number: NRC06F2002TRF; Power: 0.1W; TC: ±100ppm/°C; PressFit: No; Part Number: R0603_20K_1%_0.1W_100PPM; Component Kind: Standard; Component Type: Standard; Pin Count: 2; Value: 20k; Status: Preferred; Manufacturer Part Number: R0603_20K_1%_0.1W_100PPM; Case: 0603; Mounted: Yes; Sense: No; Socket: No; SMD: Yes; Manufacturer1 Example: NIC COMPONENT; Manufacturer1 ComponentHeight: 0.55mm; HelpURL: \\cern.ch\dfs\Applications\Altium\Datasheets\R0603_NIC_NRC.pdf; Author: CERN DEM JLC; CreateDate: 03.12.2007; LatestRevisionDate: 13.03.2008
R29-R31 R33 R55 = R0402_1k_1%_0.0625W_100PPM: Resistor - 1%; Part Description: General Purpose Thick Film Chip Resistor; Manufacturer: GENERIC; Manufacturer1 Part Number: 232270671002L; TC: ±100ppm/°C; PressFit: No; Part Number: R0402_1K_1%_0.0625W_100PPM; Component Kind: Standard; Component Type: Standard; Pin Count: 2; Value: 1k; Status: Not Recommended; Power: 0.0625W; Tolerance: ±1%; Manufacturer Part Number: R0402_1K_1%_0.0625W_100PPM; Case: 0402; Mounted: Yes; Sense: No; Socket: No; SMD: Yes; Manufacturer1 Example: YAGEO PHYCOMP; Manufacturer1 ComponentHeight: 0.4mm; HelpURL: \\cern.ch\dfs\Applications\Altium\Datasheets\R0402_Phycomp_RC0402.pdf; Author: CERN DEM JLC; CreateDate: 03.12.2007; LatestRevisionDate: 17.10.2012; ClassName: Artix
R32 = R0402_1k5_1%_0.0625W_100PPM: Resistor - 1%; Part Description: General Purpose Thick Film Chip Resistor; Manufacturer: GENERIC; Manufacturer1 Part Number: 232270671502L; TC: ±100ppm/°C; PressFit: No; Part Number: R0402_1K5_1%_0.0625W_100PPM; Component Kind: Standard; Component Type: Standard; Pin Count: 2; Value: 1k5; Status: Not Recommended; Power: 0.0625W; Tolerance: ±1%; Manufacturer Part Number: R0402_1K5_1%_0.0625W_100PPM; Case: 0402; Mounted: Yes; Sense: No; Socket: No; SMD: Yes; Manufacturer1 Example: YAGEO PHYCOMP; Manufacturer1 ComponentHeight: 0.4mm; HelpURL: \\cern.ch\dfs\Applications\Altium\Datasheets\R0402_Phycomp_RC0402.pdf; Author: CERN DEM JLC; CreateDate: 03.12.2007; LatestRevisionDate: 17.10.2012
R46 = R0402_10K_1%_0.0625W_100PPM: Resistor - 1%; Part Description: General Purpose Thick Film Chip Resistor; Manufacturer: GENERIC; Manufacturer1 Part Number: 232270671003L; TC: ±100ppm/°C; PressFit: No; Part Number: R0402_10K_1%_0.0625W_100PPM; Component Kind: Standard; Component Type: Standard; Pin Count: 2; Value: 10k; Status: Not Recommended; Power: 0.0625W; Tolerance: ±1%; Manufacturer Part Number: R0402_10K_1%_0.0625W_100PPM; Case: 0402; Mounted: Yes; Sense: No; Socket: No; SMD: Yes; Manufacturer1 Example: YAGEO PHYCOMP; Manufacturer1 ComponentHeight: 0.4mm; HelpURL: \\cern.ch\dfs\Applications\Altium\Datasheets\R0402_Phycomp_RC0402.pdf; Author: CERN DEM JLC; CreateDate: 03.12.2007; LatestRevisionDate: 17.10.2012
R58 = R0402_2K_1%_0.0625W_100PPM: Resistor - 1%; Part Description: General Purpose Thick Film Chip Resistor; Manufacturer: GENERIC; Manufacturer1 Part Number: 232270672002L; TC: ±100ppm/°C; PressFit: No; Part Number: R0402_2K_1%_0.0625W_100PPM; Component Kind: Standard; Component Type: Standard; Pin Count: 2; Value: 2k; Status: Not Recommended; Power: 0.0625W; Manufacturer Part Number: R0402_2K_1%_0.0625W_100PPM; Case: 0402; Mounted: Yes; Sense: No; Socket: No; SMD: Yes; Manufacturer1 Example: YAGEO PHYCOMP; Manufacturer1 ComponentHeight: 0.4mm; HelpURL: \\cern.ch\dfs\Applications\Altium\Datasheets\R0402_Phycomp_RC0402.pdf; Author: CERN DEM JLC; CreateDate: 03.12.2007; LatestRevisionDate: 17.10.2012
T1 T2 T4 = BSS138LT1G: N-CHANNEL MOSFET WITH DIODE; Part Description: 50V, 200mA N-Channel Enhancement Mode Field-Effect Transistor; Manufacturer: ON SEMICONDUCTOR; PressFit: No; Bonding: No; Part Number: BSS138LT1G; Component Kind: Standard; Component Type: Standard; Device: BSS138LT1G; PackageDescription: SOT23, 0.95mm Pitch; 3 Pin, 1.40mm W X 3.00mm L X 1.10mm H body, IPC Medium Density; Manufacturer Part Number: BSS138LT1G; Pin Count: 3; Case: SOT23-3; Mounted: Yes; Socket: No; SMD: Yes; Sense: No; ComponentHeight: 1.11mm; HelpURL: \\cern.ch\dfs\Applications\Altium\Datasheets\BSS138LT1G.pdf; Author: CERN DEM JLC; CreateDate: 23.03.2009; LatestRevisionDate: 23.03.2009
T3 = SI4425DDY-T1-GE3: -30V -19.7A P-Channel MOSFET; Manufacturer: VISHAY SILICONIX; PressFit: No; Bonding: No; Part Number: SI4425DDY-T1-GE3; Component Kind: Standard; Component Type: Standard; Device: SI4425DDY-T1-GE3; PackageDescription: SOIC 8, Pitch 1.27mm - Body 4x5mm, IPC Medium Density; Part Description: -30V -19.7A P-Channel MOSFET; Manufacturer Part Number: SI4425DDY-T1-GE3; Pin Count: 8; Case: SOIC8; Mounted: Yes; Socket: No; SMD: Yes; Sense: No; ComponentHeight: 1.75mm; HelpURL: \\cern.ch\dfs\Applications\Altium\Datasheets\SI4425DDY-T1-GE3.pdf; Author: CERN DEM MR; CreateDate: 05/10/2016; LatestRevisionDate: 05/10/2016

## Nets that join several sheets
GND: Hvamp_32 (72 pins), AMP_channel1 (5 pins), AMP_channel2 (5 pins), AMP_channel3 (5 pins), AMP_channel4 (5 pins), AMP_channel5 (5 pins), AMP_channel6 (5 pins), AMP_channel7 (5 pins), AMP_channel8 (5 pins), AMP_channel9 (5 pins), AMP_channel10 (5 pins), AMP_channel11 (5 pins), AMP_channel12 (5 pins), AMP_channel13 (5 pins), AMP_channel14 (5 pins), AMP_channel15 (5 pins), AMP_channel16 (5 pins), AMP_channel17 (5 pins), AMP_channel18 (5 pins), AMP_channel19 (5 pins), AMP_channel20 (5 pins), AMP_channel21 (5 pins), AMP_channel22 (5 pins), AMP_channel23 (5 pins), AMP_channel24 (5 pins), AMP_channel25 (5 pins), AMP_channel26 (5 pins), AMP_channel27 (5 pins), AMP_channel28 (5 pins), AMP_channel29 (5 pins), AMP_channel30 (5 pins), AMP_channel31 (5 pins), AMP_channel32 (5 pins), Hvamp32_Supply (63 pins)
HV_NEG: AMP_channel1 (L18_1.1), AMP_channel2 (L18_2.1), AMP_channel3 (L18_3.1), AMP_channel4 (L18_4.1), AMP_channel5 (L18_5.1), AMP_channel6 (L18_6.1), AMP_channel7 (L18_7.1), AMP_channel8 (L18_8.1), AMP_channel9 (L18_9.1), AMP_channel10 (L18_10.1), AMP_channel11 (L18_11.1), AMP_channel12 (L18_12.1), AMP_channel13 (L18_13.1), AMP_channel14 (L18_14.1), AMP_channel15 (L18_15.1), AMP_channel16 (L18_16.1), AMP_channel17 (L18_17.1), AMP_channel18 (L18_18.1), AMP_channel19 (L18_19.1), AMP_channel20 (L18_20.1), AMP_channel21 (L18_21.1), AMP_channel22 (L18_22.1), AMP_channel23 (L18_23.1), AMP_channel24 (L18_24.1), AMP_channel25 (L18_25.1), AMP_channel26 (L18_26.1), AMP_channel27 (L18_27.1), AMP_channel28 (L18_28.1), AMP_channel29 (L18_29.1), AMP_channel30 (L18_30.1), AMP_channel31 (L18_31.1), AMP_channel32 (L18_32.1), Hvamp32_Supply (5 pins)
HV_POS: AMP_channel1 (L2_1.1), AMP_channel2 (L2_2.1), AMP_channel3 (L2_3.1), AMP_channel4 (L2_4.1), AMP_channel5 (L2_5.1), AMP_channel6 (L2_6.1), AMP_channel7 (L2_7.1), AMP_channel8 (L2_8.1), AMP_channel9 (L2_9.1), AMP_channel10 (L2_10.1), AMP_channel11 (L2_11.1), AMP_channel12 (L2_12.1), AMP_channel13 (L2_13.1), AMP_channel14 (L2_14.1), AMP_channel15 (L2_15.1), AMP_channel16 (L2_16.1), AMP_channel17 (L2_17.1), AMP_channel18 (L2_18.1), AMP_channel19 (L2_19.1), AMP_channel20 (L2_20.1), AMP_channel21 (L2_21.1), AMP_channel22 (L2_22.1), AMP_channel23 (L2_23.1), AMP_channel24 (L2_24.1), AMP_channel25 (L2_25.1), AMP_channel26 (L2_26.1), AMP_channel27 (L2_27.1), AMP_channel28 (L2_28.1), AMP_channel29 (L2_29.1), AMP_channel30 (L2_30.1), AMP_channel31 (L2_31.1), AMP_channel32 (L2_32.1), Hvamp32_Supply (5 pins)
IN_N1: Hvamp_32 (J3.2 J9.2), AMP_channel1 (R3_1.1)
IN_N2: Hvamp_32 (J3.5 J9.5), AMP_channel2 (R3_2.1)
IN_N3: Hvamp_32 (J3.8 J9.8), AMP_channel3 (R3_3.1)
IN_N4: Hvamp_32 (J3.11 J9.11), AMP_channel4 (R3_4.1)
IN_N5: Hvamp_32 (J3.14 J9.14), AMP_channel5 (R3_5.1)
IN_N6: Hvamp_32 (J3.17 J9.17), AMP_channel6 (R3_6.1)
IN_N7: Hvamp_32 (J3.20 J9.20), AMP_channel7 (R3_7.1)
IN_N8: Hvamp_32 (J3.23 J9.23), AMP_channel8 (R3_8.1)
IN_N9: Hvamp_32 (J4.2 J6.2), AMP_channel9 (R3_9.1)
IN_N10: Hvamp_32 (J4.5 J6.5), AMP_channel10 (R3_10.1)
IN_N11: Hvamp_32 (J4.8 J6.8), AMP_channel11 (R3_11.1)
IN_N12: Hvamp_32 (J4.11 J6.11), AMP_channel12 (R3_12.1)
IN_N13: Hvamp_32 (J4.14 J6.14), AMP_channel13 (R3_13.1)
IN_N14: Hvamp_32 (J4.17 J6.17), AMP_channel14 (R3_14.1)
IN_N15: Hvamp_32 (J4.20 J6.20), AMP_channel15 (R3_15.1)
IN_N16: Hvamp_32 (J4.23 J6.23), AMP_channel16 (R3_16.1)
IN_N17: Hvamp_32 (J2.2 J5.2), AMP_channel17 (R3_17.1)
IN_N18: Hvamp_32 (J2.5 J5.5), AMP_channel18 (R3_18.1)
IN_N19: Hvamp_32 (J2.8 J5.8), AMP_channel19 (R3_19.1)
IN_N20: Hvamp_32 (J2.11 J5.11), AMP_channel20 (R3_20.1)
IN_N21: Hvamp_32 (J2.14 J5.14), AMP_channel21 (R3_21.1)
IN_N22: Hvamp_32 (J2.17 J5.17), AMP_channel22 (R3_22.1)
IN_N23: Hvamp_32 (J2.20 J5.20), AMP_channel23 (R3_23.1)
IN_N24: Hvamp_32 (J2.23 J5.23), AMP_channel24 (R3_24.1)
IN_N25: Hvamp_32 (J7.2 J8.2), AMP_channel25 (R3_25.1)
IN_N26: Hvamp_32 (J7.5 J8.5), AMP_channel26 (R3_26.1)
IN_N27: Hvamp_32 (J7.8 J8.8), AMP_channel27 (R3_27.1)
IN_N28: Hvamp_32 (J7.11 J8.11), AMP_channel28 (R3_28.1)
IN_N29: Hvamp_32 (J7.14 J8.14), AMP_channel29 (R3_29.1)
IN_N30: Hvamp_32 (J7.17 J8.17), AMP_channel30 (R3_30.1)
IN_N31: Hvamp_32 (J7.20 J8.20), AMP_channel31 (R3_31.1)
IN_N32: Hvamp_32 (J7.23 J8.23), AMP_channel32 (R3_32.1)
IN_P1: Hvamp_32 (J3.1 J9.1), AMP_channel1 (R4_1.1)
IN_P2: Hvamp_32 (J3.4 J9.4), AMP_channel2 (R4_2.1)
IN_P3: Hvamp_32 (J3.7 J9.7), AMP_channel3 (R4_3.1)
IN_P4: Hvamp_32 (J3.10 J9.10), AMP_channel4 (R4_4.1)
IN_P5: Hvamp_32 (J3.13 J9.13), AMP_channel5 (R4_5.1)
IN_P6: Hvamp_32 (J3.16 J9.16), AMP_channel6 (R4_6.1)
IN_P7: Hvamp_32 (J3.19 J9.19), AMP_channel7 (R4_7.1)
IN_P8: Hvamp_32 (J3.22 J9.22), AMP_channel8 (R4_8.1)
IN_P9: Hvamp_32 (J4.1 J6.1), AMP_channel9 (R4_9.1)
IN_P10: Hvamp_32 (J4.4 J6.4), AMP_channel10 (R4_10.1)
IN_P11: Hvamp_32 (J4.7 J6.7), AMP_channel11 (R4_11.1)
IN_P12: Hvamp_32 (J4.10 J6.10), AMP_channel12 (R4_12.1)
IN_P13: Hvamp_32 (J4.13 J6.13), AMP_channel13 (R4_13.1)
IN_P14: Hvamp_32 (J4.16 J6.16), AMP_channel14 (R4_14.1)
IN_P15: Hvamp_32 (J4.19 J6.19), AMP_channel15 (R4_15.1)
IN_P16: Hvamp_32 (J4.22 J6.22), AMP_channel16 (R4_16.1)
IN_P17: Hvamp_32 (J2.1 J5.1), AMP_channel17 (R4_17.1)
IN_P18: Hvamp_32 (J2.4 J5.4), AMP_channel18 (R4_18.1)
IN_P19: Hvamp_32 (J2.7 J5.7), AMP_channel19 (R4_19.1)
IN_P20: Hvamp_32 (J2.10 J5.10), AMP_channel20 (R4_20.1)
IN_P21: Hvamp_32 (J2.13 J5.13), AMP_channel21 (R4_21.1)
IN_P22: Hvamp_32 (J2.16 J5.16), AMP_channel22 (R4_22.1)
IN_P23: Hvamp_32 (J2.19 J5.19), AMP_channel23 (R4_23.1)
IN_P24: Hvamp_32 (J2.22 J5.22), AMP_channel24 (R4_24.1)
IN_P25: Hvamp_32 (J7.1 J8.1), AMP_channel25 (R4_25.1)
IN_P26: Hvamp_32 (J7.4 J8.4), AMP_channel26 (R4_26.1)
IN_P27: Hvamp_32 (J7.7 J8.7), AMP_channel27 (R4_27.1)
IN_P28: Hvamp_32 (J7.10 J8.10), AMP_channel28 (R4_28.1)
IN_P29: Hvamp_32 (J7.13 J8.13), AMP_channel29 (R4_29.1)
IN_P30: Hvamp_32 (J7.16 J8.16), AMP_channel30 (R4_30.1)
IN_P31: Hvamp_32 (J7.19 J8.19), AMP_channel31 (R4_31.1)
IN_P32: Hvamp_32 (J7.22 J8.22), AMP_channel32 (R4_32.1)
NetD2_1_2: AMP_channel1 (D2_1.2), AMP_channel2 (D2_2.2), AMP_channel3 (D2_3.2), AMP_channel4 (D2_4.2), AMP_channel5 (D2_5.2), AMP_channel6 (D2_6.2), AMP_channel7 (D2_7.2), AMP_channel8 (D2_8.2), AMP_channel9 (D2_9.2), AMP_channel10 (D2_10.2), AMP_channel11 (D2_11.2), AMP_channel12 (D2_12.2), AMP_channel13 (D2_13.2), AMP_channel14 (D2_14.2), AMP_channel15 (D2_15.2), AMP_channel16 (D2_16.2), AMP_channel17 (D2_17.2), AMP_channel18 (D2_18.2), AMP_channel19 (D2_19.2), AMP_channel20 (D2_20.2), AMP_channel21 (D2_21.2), AMP_channel22 (D2_22.2), AMP_channel23 (D2_23.2), AMP_channel24 (D2_24.2), AMP_channel25 (D2_25.2), AMP_channel26 (D2_26.2), AMP_channel27 (D2_27.2), AMP_channel28 (D2_28.2), AMP_channel29 (D2_29.2), AMP_channel30 (D2_30.2), AMP_channel31 (D2_31.2), AMP_channel32 (D2_32.2), Hvamp32_Supply (R26.1 T4.1)
OUT_N: Hvamp_32 (J1.35), AMP_channel1 (R67_1.2)
OUT_N: Hvamp_32 (J1.36), AMP_channel2 (R67_2.2)
OUT_N: Hvamp_32 (J1.37), AMP_channel3 (R67_3.2)
OUT_N: Hvamp_32 (J1.38), AMP_channel4 (R67_4.2)
OUT_N: Hvamp_32 (J1.39), AMP_channel5 (R67_5.2)
OUT_N: Hvamp_32 (J1.40), AMP_channel6 (R67_6.2)
OUT_N: Hvamp_32 (J1.41), AMP_channel7 (R67_7.2)
OUT_N: Hvamp_32 (J1.42), AMP_channel8 (R67_8.2)
OUT_N: Hvamp_32 (J1.43), AMP_channel9 (R67_9.2)
OUT_N: Hvamp_32 (J1.44), AMP_channel10 (R67_10.2)
OUT_N: Hvamp_32 (J1.45), AMP_channel11 (R67_11.2)
OUT_N: Hvamp_32 (J1.46), AMP_channel12 (R67_12.2)
OUT_N: Hvamp_32 (J1.47), AMP_channel13 (R67_13.2)
OUT_N: Hvamp_32 (J1.48), AMP_channel14 (R67_14.2)
OUT_N: Hvamp_32 (J1.49), AMP_channel15 (R67_15.2)
OUT_N: Hvamp_32 (J1.50), AMP_channel16 (R67_16.2)
OUT_N: Hvamp_32 (J1.53), AMP_channel17 (R67_17.2)
OUT_N: Hvamp_32 (J1.54), AMP_channel18 (R67_18.2)
OUT_N: Hvamp_32 (J1.55), AMP_channel19 (R67_19.2)
OUT_N: Hvamp_32 (J1.56), AMP_channel20 (R67_20.2)
OUT_N: Hvamp_32 (J1.57), AMP_channel21 (R67_21.2)
OUT_N: Hvamp_32 (J1.58), AMP_channel22 (R67_22.2)
OUT_N: Hvamp_32 (J1.59), AMP_channel23 (R67_23.2)
OUT_N: Hvamp_32 (J1.60), AMP_channel24 (R67_24.2)
OUT_N: Hvamp_32 (J1.61), AMP_channel25 (R67_25.2)
OUT_N: Hvamp_32 (J1.62), AMP_channel26 (R67_26.2)
OUT_N: Hvamp_32 (J1.63), AMP_channel27 (R67_27.2)
OUT_N: Hvamp_32 (J1.64), AMP_channel28 (R67_28.2)
OUT_N: Hvamp_32 (J1.65), AMP_channel29 (R67_29.2)
OUT_N: Hvamp_32 (J1.66), AMP_channel30 (R67_30.2)
OUT_N: Hvamp_32 (J1.67), AMP_channel31 (R67_31.2)
OUT_N: Hvamp_32 (J1.68), AMP_channel32 (R67_32.2)
OUT_P: Hvamp_32 (J1.1), AMP_channel1 (D21_1.3 R2_1.2)
OUT_P: Hvamp_32 (J1.2), AMP_channel2 (D21_2.3 R2_2.2)
OUT_P: Hvamp_32 (J1.3), AMP_channel3 (D21_3.3 R2_3.2)
OUT_P: Hvamp_32 (J1.4), AMP_channel4 (D21_4.3 R2_4.2)
OUT_P: Hvamp_32 (J1.5), AMP_channel5 (D21_5.3 R2_5.2)
OUT_P: Hvamp_32 (J1.6), AMP_channel6 (D21_6.3 R2_6.2)
OUT_P: Hvamp_32 (J1.7), AMP_channel7 (D21_7.3 R2_7.2)
OUT_P: Hvamp_32 (J1.8), AMP_channel8 (D21_8.3 R2_8.2)
OUT_P: Hvamp_32 (J1.9), AMP_channel9 (D21_9.3 R2_9.2)
OUT_P: Hvamp_32 (J1.10), AMP_channel10 (D21_10.3 R2_10.2)
OUT_P: Hvamp_32 (J1.11), AMP_channel11 (D21_11.3 R2_11.2)
OUT_P: Hvamp_32 (J1.12), AMP_channel12 (D21_12.3 R2_12.2)
OUT_P: Hvamp_32 (J1.13), AMP_channel13 (D21_13.3 R2_13.2)
OUT_P: Hvamp_32 (J1.14), AMP_channel14 (D21_14.3 R2_14.2)
OUT_P: Hvamp_32 (J1.15), AMP_channel15 (D21_15.3 R2_15.2)
OUT_P: Hvamp_32 (J1.16), AMP_channel16 (D21_16.3 R2_16.2)
OUT_P: Hvamp_32 (J1.19), AMP_channel17 (D21_17.3 R2_17.2)
OUT_P: Hvamp_32 (J1.20), AMP_channel18 (D21_18.3 R2_18.2)
OUT_P: Hvamp_32 (J1.21), AMP_channel19 (D21_19.3 R2_19.2)
OUT_P: Hvamp_32 (J1.22), AMP_channel20 (D21_20.3 R2_20.2)
OUT_P: Hvamp_32 (J1.23), AMP_channel21 (D21_21.3 R2_21.2)
OUT_P: Hvamp_32 (J1.24), AMP_channel22 (D21_22.3 R2_22.2)
OUT_P: Hvamp_32 (J1.25), AMP_channel23 (D21_23.3 R2_23.2)
OUT_P: Hvamp_32 (J1.26), AMP_channel24 (D21_24.3 R2_24.2)
OUT_P: Hvamp_32 (J1.27), AMP_channel25 (D21_25.3 R2_25.2)
OUT_P: Hvamp_32 (J1.28), AMP_channel26 (D21_26.3 R2_26.2)
OUT_P: Hvamp_32 (J1.29), AMP_channel27 (D21_27.3 R2_27.2)
OUT_P: Hvamp_32 (J1.30), AMP_channel28 (D21_28.3 R2_28.2)
OUT_P: Hvamp_32 (J1.31), AMP_channel29 (D21_29.3 R2_29.2)
OUT_P: Hvamp_32 (J1.32), AMP_channel30 (D21_30.3 R2_30.2)
OUT_P: Hvamp_32 (J1.33), AMP_channel31 (D21_31.3 R2_31.2)
OUT_P: Hvamp_32 (J1.34), AMP_channel32 (D21_32.3 R2_32.2)

## Assembly variants
STD: not fitted IC2 IC4 IC5 IC7 J3 J4 J5 J7 R7 R12 R16 R22
+-55V: not fitted IC2 IC4 IC5 IC7 J3 J4 J5 J7 R7 R12 R16 R22; alternate parts R1_26 -> R0603_165K_0.1%_0.063W_10PPM, R1_23 -> R0603_165K_0.1%_0.063W_10PPM, R1_24 -> R0603_165K_0.1%_0.063W_10PPM, R1_25 -> R0603_165K_0.1%_0.063W_10PPM, R1_22 -> R0603_165K_0.1%_0.063W_10PPM, R1_21 -> R0603_165K_0.1%_0.063W_10PPM, R1_20 -> R0603_165K_0.1%_0.063W_10PPM, R1_19 -> R0603_165K_0.1%_0.063W_10PPM, R1_16 -> R0603_165K_0.1%_0.063W_10PPM, R1_17 -> R0603_165K_0.1%_0.063W_10PPM, R1_15 -> R0603_165K_0.1%_0.063W_10PPM, R1_18 -> R0603_165K_0.1%_0.063W_10PPM, R1_14 -> R0603_165K_0.1%_0.063W_10PPM, R1_30 -> R0603_165K_0.1%_0.063W_10PPM, R1_31 -> R0603_165K_0.1%_0.063W_10PPM, R1_32 -> R0603_165K_0.1%_0.063W_10PPM, R1_29 -> R0603_165K_0.1%_0.063W_10PPM, R1_28 -> R0603_165K_0.1%_0.063W_10PPM, R1_27 -> R0603_165K_0.1%_0.063W_10PPM, R1_1 -> R0603_165K_0.1%_0.063W_10PPM, R1_13 -> R0603_165K_0.1%_0.063W_10PPM, R1_2 -> R0603_165K_0.1%_0.063W_10PPM, R1_3 -> R0603_165K_0.1%_0.063W_10PPM, R1_4 -> R0603_165K_0.1%_0.063W_10PPM, R1_5 -> R0603_165K_0.1%_0.063W_10PPM, R1_6 -> R0603_165K_0.1%_0.063W_10PPM, R1_7 -> R0603_165K_0.1%_0.063W_10PPM, R1_8 -> R0603_165K_0.1%_0.063W_10PPM, R1_9 -> R0603_165K_0.1%_0.063W_10PPM, R1_10 -> R0603_165K_0.1%_0.063W_10PPM, R1_11 -> R0603_165K_0.1%_0.063W_10PPM, R1_12 -> R0603_165K_0.1%_0.063W_10PPM, R5_1 -> R0603_165K_0.1%_0.063W_10PPM, R5_2 -> R0603_165K_0.1%_0.063W_10PPM, R5_3 -> R0603_165K_0.1%_0.063W_10PPM, R5_4 -> R0603_165K_0.1%_0.063W_10PPM, R5_5 -> R0603_165K_0.1%_0.063W_10PPM, R5_6 -> R0603_165K_0.1%_0.063W_10PPM, R5_7 -> R0603_165K_0.1%_0.063W_10PPM, R5_8 -> R0603_165K_0.1%_0.063W_10PPM, R5_9 -> R0603_165K_0.1%_0.063W_10PPM, R5_10 -> R0603_165K_0.1%_0.063W_10PPM, R5_11 -> R0603_165K_0.1%_0.063W_10PPM, R5_12 -> R0603_165K_0.1%_0.063W_10PPM, R5_13 -> R0603_165K_0.1%_0.063W_10PPM, R5_14 -> R0603_165K_0.1%_0.063W_10PPM, R5_15 -> R0603_165K_0.1%_0.063W_10PPM, R5_16 -> R0603_165K_0.1%_0.063W_10PPM, R5_17 -> R0603_165K_0.1%_0.063W_10PPM, R5_26 -> R0603_165K_0.1%_0.063W_10PPM, R5_27 -> R0603_165K_0.1%_0.063W_10PPM, R5_28 -> R0603_165K_0.1%_0.063W_10PPM, R5_29 -> R0603_165K_0.1%_0.063W_10PPM, R5_30 -> R0603_165K_0.1%_0.063W_10PPM, R5_31 -> R0603_165K_0.1%_0.063W_10PPM, R5_32 -> R0603_165K_0.1%_0.063W_10PPM, R5_25 -> R0603_165K_0.1%_0.063W_10PPM, R5_24 -> R0603_165K_0.1%_0.063W_10PPM, R5_23 -> R0603_165K_0.1%_0.063W_10PPM, R5_22 -> R0603_165K_0.1%_0.063W_10PPM, R5_21 -> R0603_165K_0.1%_0.063W_10PPM, R5_20 -> R0603_165K_0.1%_0.063W_10PPM, R5_19 -> R0603_165K_0.1%_0.063W_10PPM, R5_18 -> R0603_165K_0.1%_0.063W_10PPM, R20 -> R1206_5K6_1%_0.25W_100PPM, R35 -> R1206_5K6_1%_0.25W_100PPM